# Altium project Pitendo_Main.PrjPcb
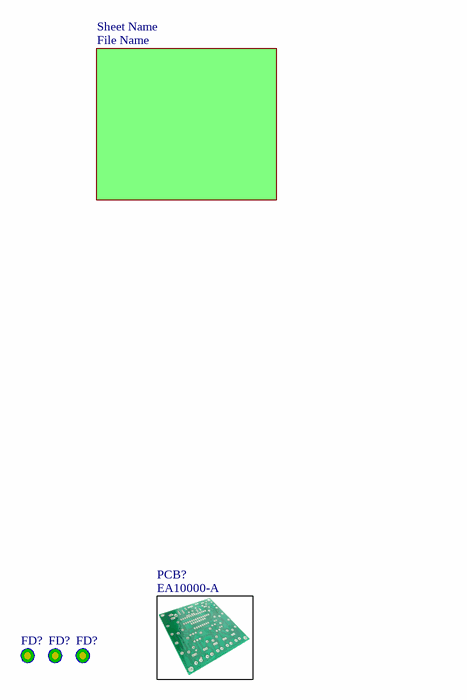
[diagram p0: Overview.SchDoc]
Q_EA_Comment_BOM: No comment; Q_EA_Created: YYYY-MM-DD when released; Q_EA_Created_By: Förnamn Efternamn; Q_EA_DesignDefaultTemperature: -x°C to y°C; Q_EA_Last_Revised_By: First release; Q_EA_Part_Name: PCBA Name; Q_EA_Part_Number: EA10000; Q_EA_Revision_BOM: 1; Q_EA_Revision_Layout: A; Q_EA_Status: Draft
1 sheet, 4 parts. Net scope: strictly hierarchical (ports join the sheet entries above them; power ports are local).
Board file: Pitendo_Main.PcbDoc

## Sheet Overview.SchDoc
size A4; CompanyName: QRTECH AB; Address1: SWEDEN; SheetNumber: 1; SheetTotal: 100; PageSetup: Record=PageOptions|CenterHorizontal=True|CenterVertical=True|PrintScale=0.97|XCorrection=1.00|YCorrection=1.00|PrintKind=0|BorderSize=5000000|LeftOffset=0|BottomOffset=0|Orientation=2|PaperLength=1000|PaperWidth=1000|Scale=100|PaperSource=7|PrintQuality=-4|MediaType=1|DitherType=10|PaperKind=A4|PrintScaleMode=1; Q_Sheet_Created_By: Förnamn Efternamn; Q_Sheet_Status: Draft

### Parts
(Parts that share a designator on the sheet are numbered #1, #2 ... from top to bottom, then left to right.)
FD?#1  PCB_FDC_x1_p0-1  [PCB_FDC100-A1]  (value not drawn)  (no BOM)
FD?#2  PCB_FDC_x1_p0-1  [PCB_FDC100-A1]  (value not drawn)  (no BOM)
FD?#3  PCB_FDC_x1_p0-1  [PCB_FDC100-A1]  (value not drawn)  (no BOM)
PCB?  PCB_x1_p0-1  (value not drawn)  (mechanical)

### Sub-sheets
SheetSymbolDesignator = File Name (file not in this document): no entries  | SheetSymbolDesignator: Sheet Name

### Library data of the parts
FD?#1-FD?#3 = Fiducial_Circular-1: PartNumber: EP10906; ManufacturerPartNumber: Fiducial_Circular-1; Status: Preliminary
PCB? = PCB: ManufacturerPartNumber: PCB; PartNumber: EP10930; Q_EA_DesignDefaultTemperature: -x°C to y°C; BomComment: EA10000-A; Status: Preliminary

## Assembly variants
1 Production: all parts fitted